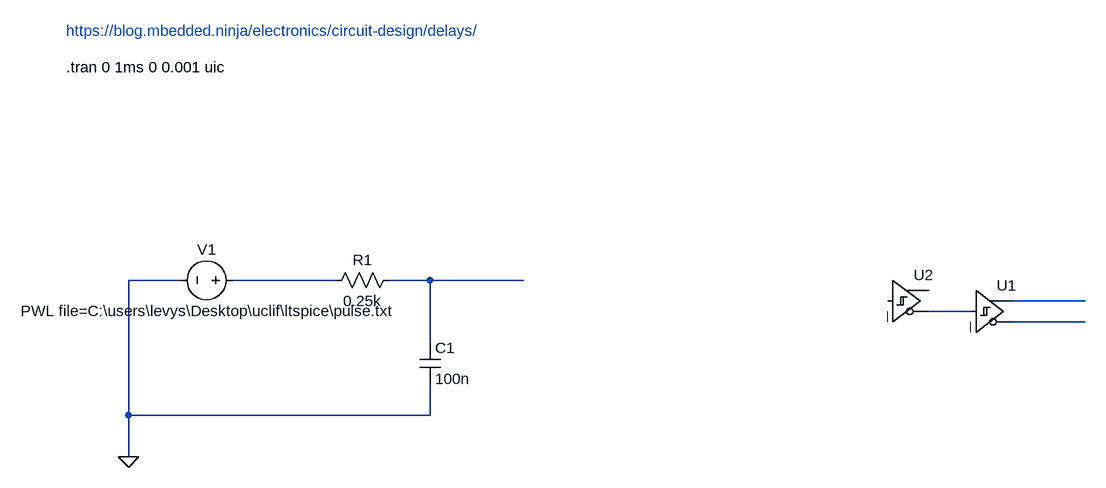
[diagram p0: schematic schmitts.asc]
schmitts.asc, the LTspice schematic file:
Version 4
SHEET 1 4500 760
WIRE -192 112 -272 112
WIRE 48 112 -112 112
WIRE 192 112 128 112
WIRE 336 112 192 112
WIRE 1200 144 1088 144
WIRE 1024 160 960 160
WIRE 1200 176 1088 176
WIRE 192 208 192 112
WIRE -272 320 -272 112
WIRE 192 320 192 272
WIRE 192 320 -272 320
WIRE -272 384 -272 320
FLAG -272 384 0
SYMBOL res 144 96 R90
WINDOW 0 0 56 VBottom 2
WINDOW 3 32 56 VTop 2
SYMATTR InstName R1
SYMATTR Value 0.25k
SYMATTR SpiceLine tol=1 pwr=0.1
SYMBOL cap 176 208 R0
SYMATTR InstName C1
SYMATTR Value 100n
SYMBOL voltage -96 112 M270
WINDOW 0 32 56 VTop 2
WINDOW 3 -32 56 VBottom 2
WINDOW 123 0 0 Left 0
WINDOW 39 0 0 Left 0
SYMATTR InstName V1
SYMATTR Value PWL file=C:\users\levys\Desktop\uclif\ltspice\pulse.txt
SYMBOL Digital\\schmitt 896 80 R0
SYMATTR InstName U2
SYMBOL Digital\\schmitt 1024 96 R0
SYMATTR InstName U1
TEXT -368 -216 Left 2 !.tran 0 1ms 0 0.001 uic
TEXT -368 -272 Left 2 ;https://blog.mbedded.ninja/electronics/circuit-design/delays/

The netlist it stands for:
* schmitts.asc
R1 N002 N001 0.25k tol=1 pwr=0.1
C1 N002 0 100n
V1 N001 0 PWL file=C:\users\levys\Desktop\uclif\ltspice\pulse.txt
A§U2 0 0 0 0 0 N004 0 0 SCHMITT
A§U1 N004 0 0 0 0 N005 N003 0 SCHMITT
.tran 0 1ms 0 0.001 uic
* https://blog.mbedded.ninja/electronics/circuit-design/delays/
.backanno
.end